# Altium schematic sheet Main_SCH.SchDoc
size A1
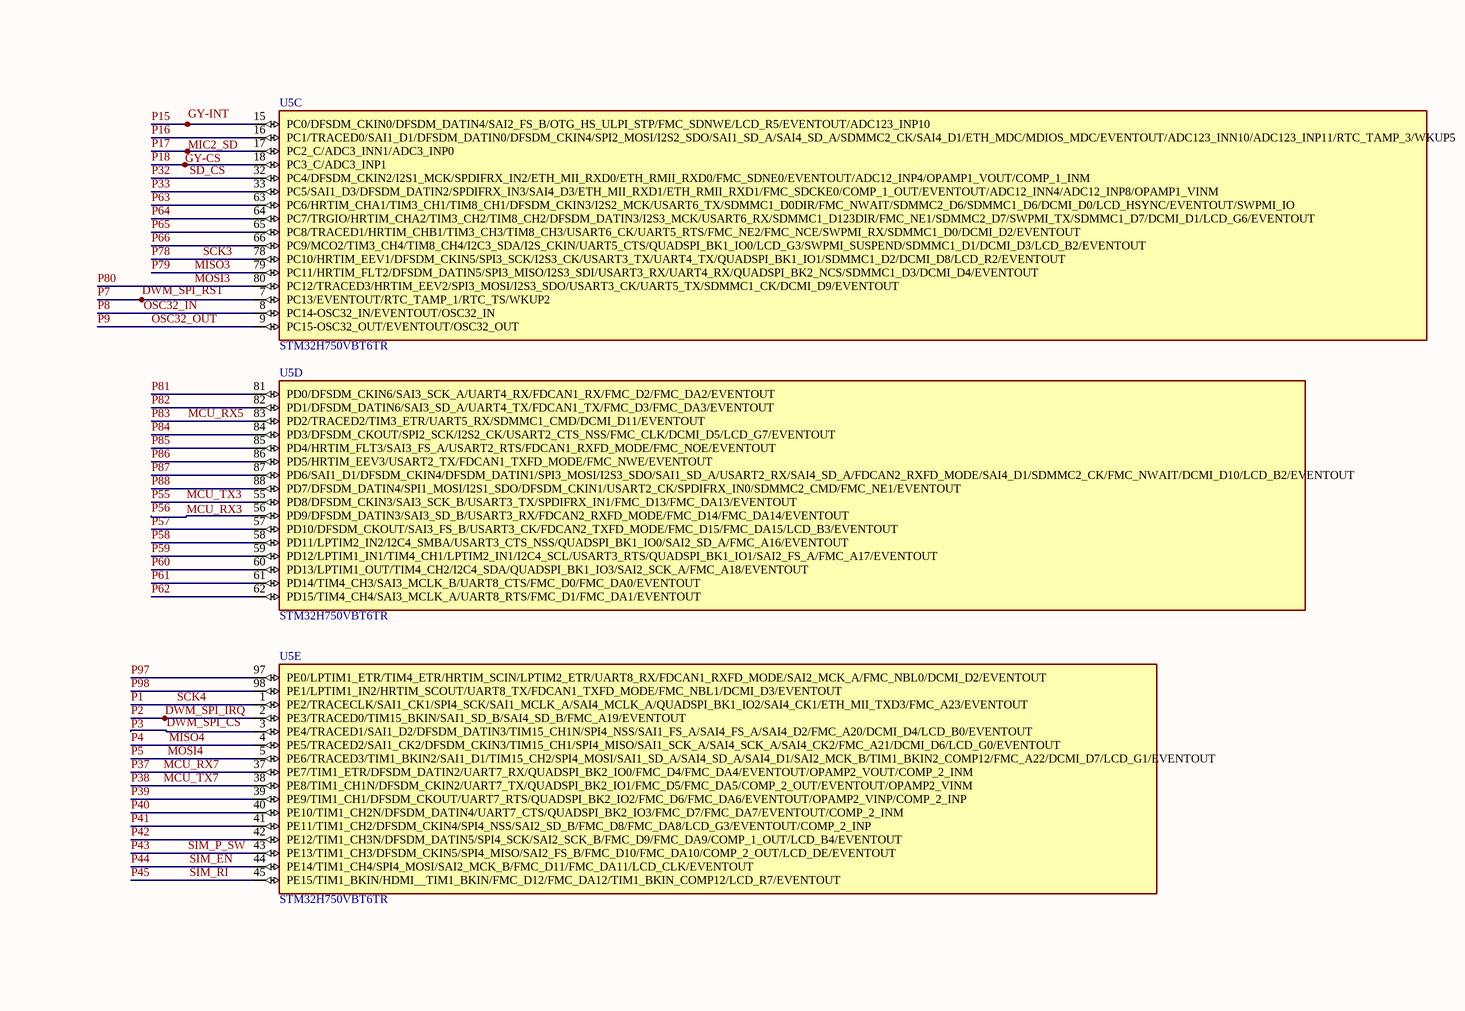
[diagram p0: Main_SCH.SchDoc, top left]
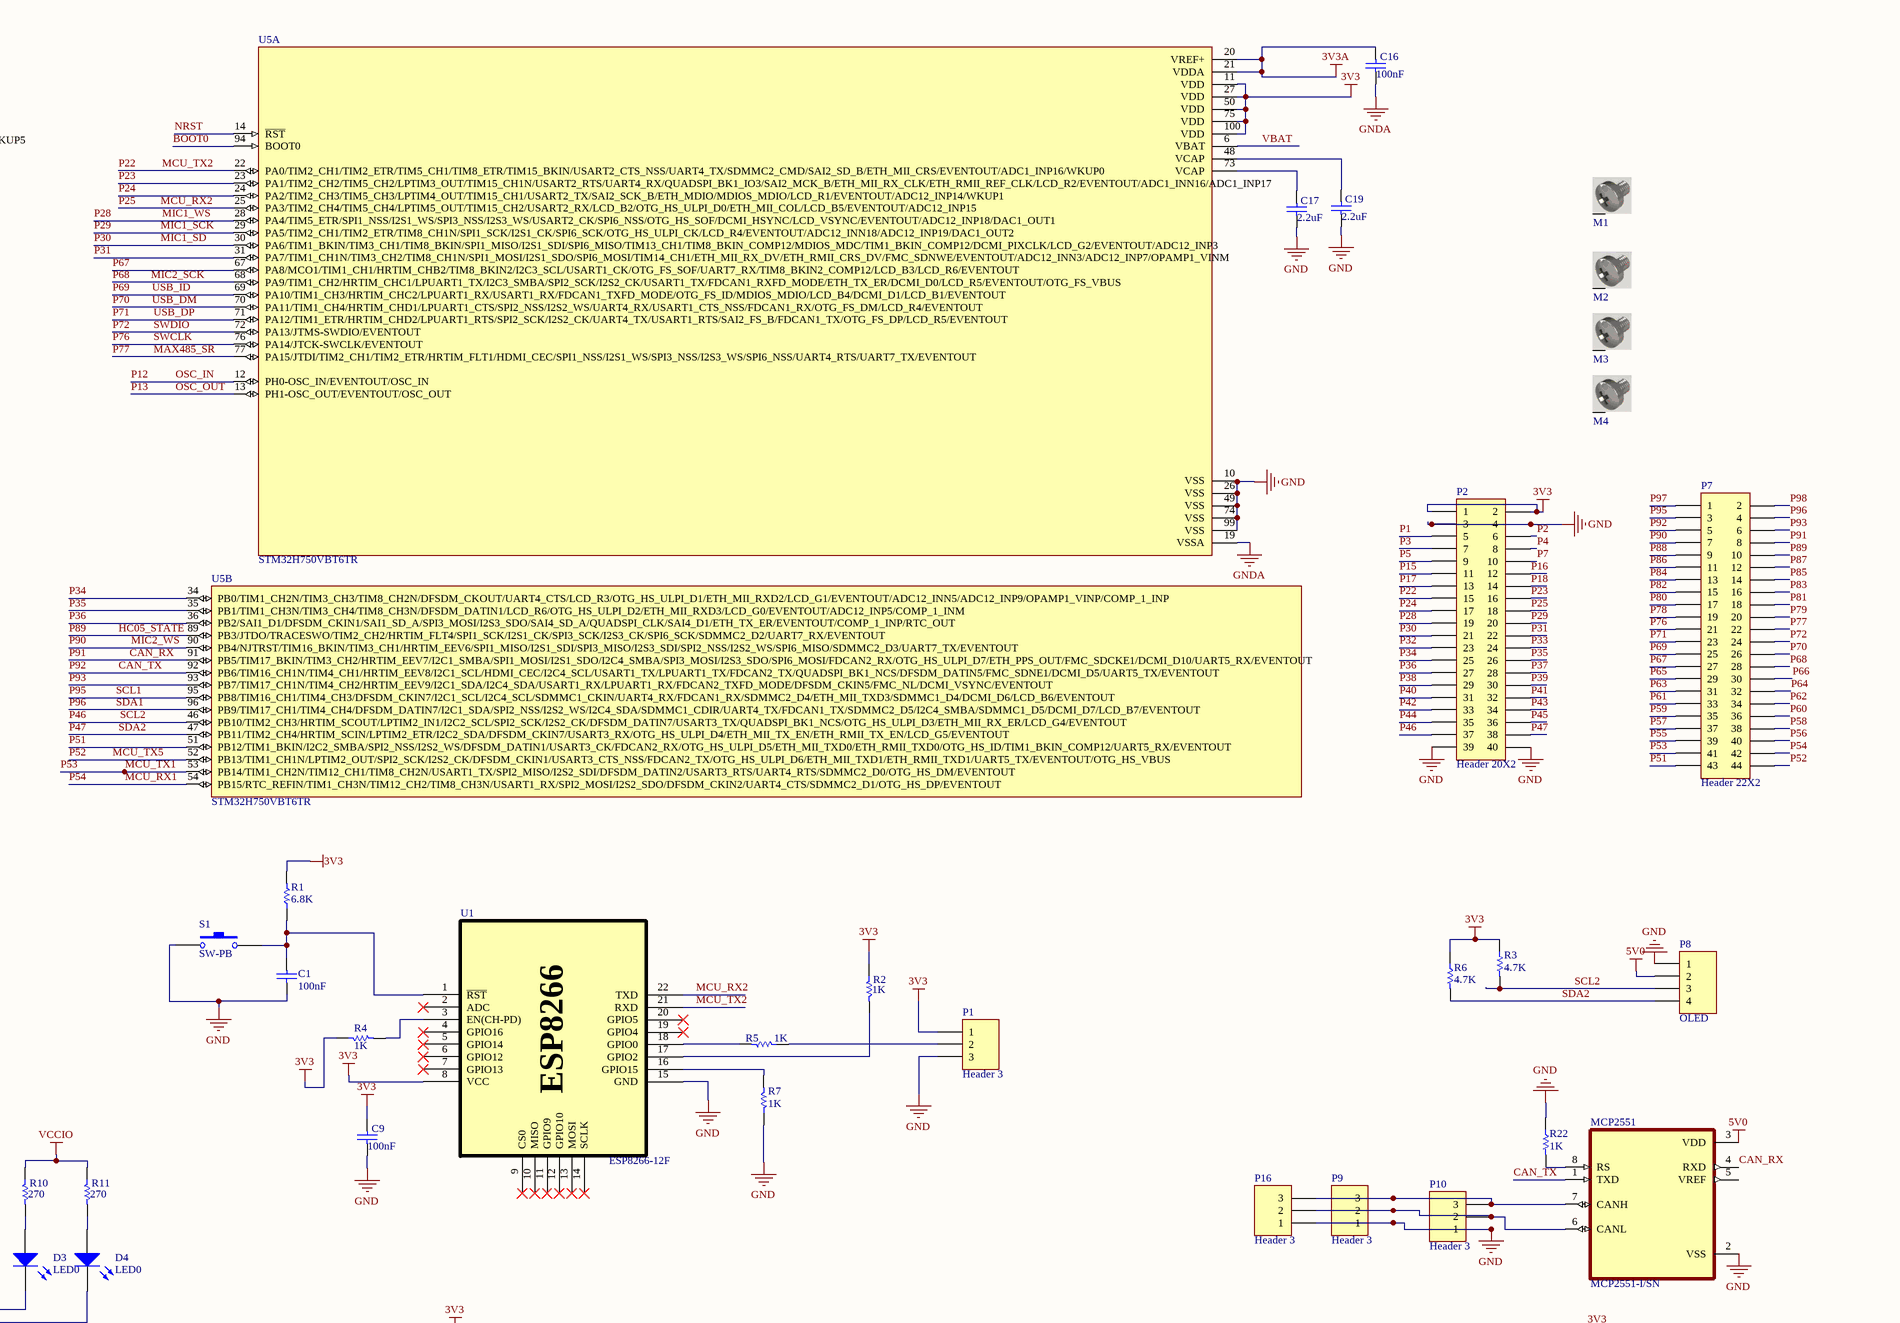
[diagram p1: Main_SCH.SchDoc, top right]
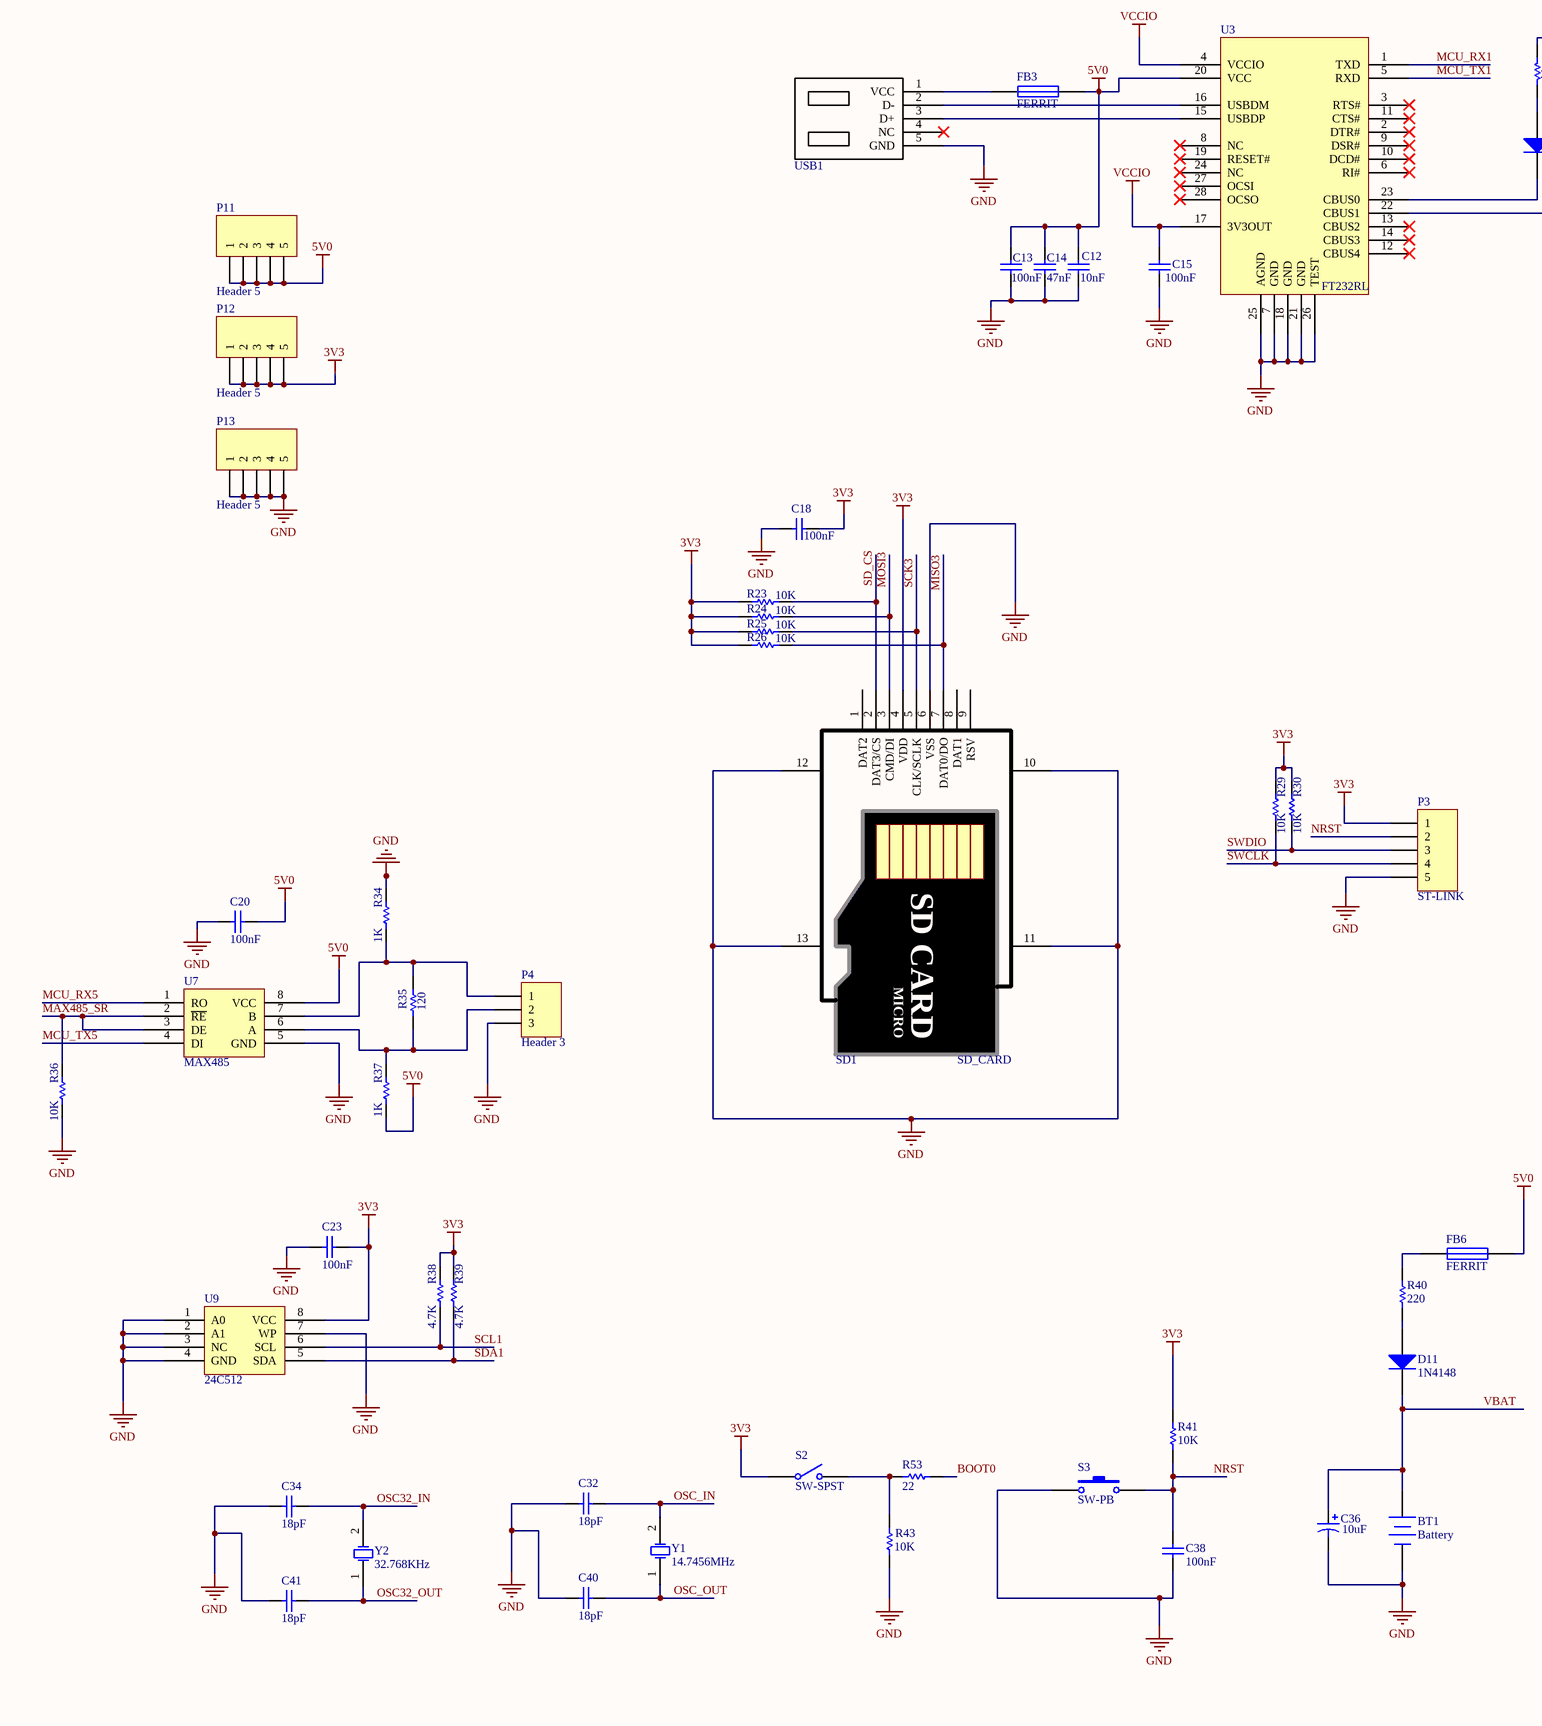
[diagram p2: Main_SCH.SchDoc, bottom left]
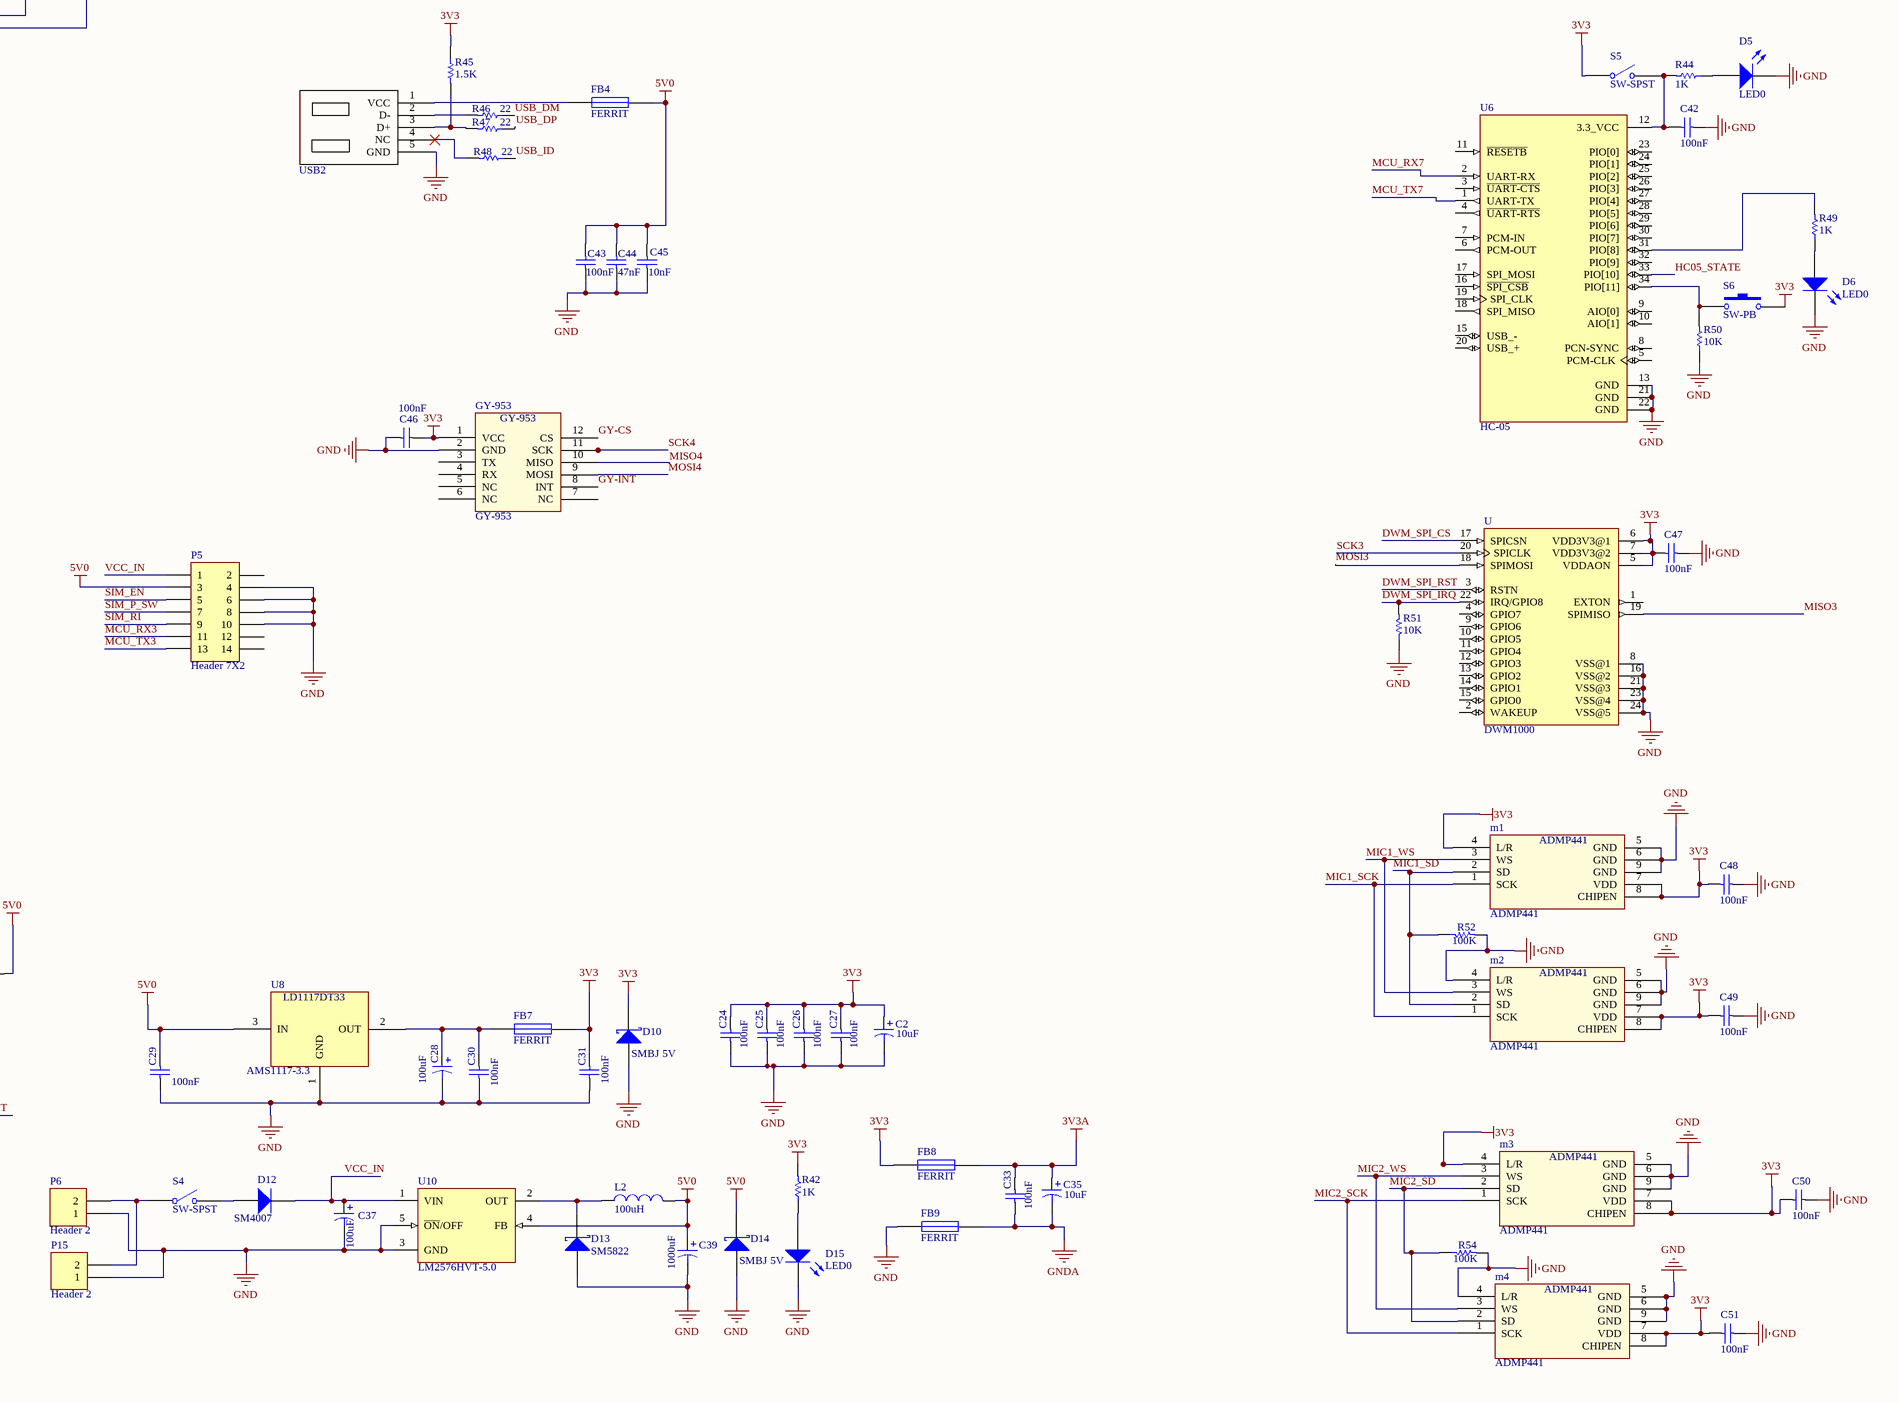
[diagram p3: Main_SCH.SchDoc, bottom right]

## Parts
(Parts that share a designator on the sheet are numbered #1, #2 ... from top to bottom, then left to right.)
BT1  Battery  [CHARGING_BATT]
C1  100nF  [SMD_805]
C2  10uF  [C_B]
C9  100nF  [SMD_805]
C12  10nF  [SMD_805]
C13  100nF  [SMD_805]
C14  47nF  [SMD_805]
C15  100nF  [SMD_805]
C16  100nF  [SMD_805]
C17  2.2uF  [SMD_805]
C18  100nF  [SMD_805]
C19  2.2uF  [SMD_805]
C20  100nF  [SMD_805]
C23  100nF  [SMD_805]
C24  100nF  [SMD_805]
C25  100nF  [SMD_805]
C26  100nF  [SMD_805]
C27  100nF  [SMD_805]
C28  100uF  [C_B]
C29  100nF  [SMD_805]
C30  100nF  [SMD_805]
C31  100nF  [SMD_805]
C32  18pF  [SMD_805]
C33  100nF  [SMD_805]
C34  18pF  [SMD_805]
C35  10uF  [C_B]
C36  10uF  [C_B]
C37  100uF  [C_CYL_SMD2]
C38  100nF  [SMD_805]
C39  1000uF  [C_CYL_SMD]
C40  18pF  [SMD_805]
C41  18pF  [SMD_805]
C42  100nF  [SMD_805]
C43  100nF  [SMD_805]
C44  47nF  [SMD_805]
C45  10nF  [SMD_805]
C46  100nF  [SMD_805]
C47  100nF  [SMD_805]
C48  100nF  [SMD_805]
C49  100nF  [SMD_805]
C50  100nF  [SMD_805]
C51  100nF  [SMD_805]
D3  LED0  [SMD_805]
D4  LED0  [SMD_805]
D5  LED0  [SMD_805]
D6  LED0  [SMD_805]
D10  SMBJ 5V  [tvs]
D11  1N4148  [TVS]
D12  SM4007  [TVS]
D13  SM5822  [DO_214_AB_SMC]
D14  SMBJ 5V  [TVS]
D15  LED0  [SMD_805]
FB3  FERRIT  [SMD_805]
FB4  FERRIT  [SMD_805]
FB6  FERRIT  [SMD_805]
FB7  FERRIT  [SMD_805]
FB8  FERRIT  [SMD_805]
FB9  FERRIT  [SMD_805]
GY-953  GY-953  [GY-953]
L2  100uH  [INDUC_SMD]
M1#1  Screw  [Board Screw_No Silk]  (value not drawn)
m1#2  ADMP441  [ADMP441]
M2#1  Screw  [Board Screw_No Silk]  (value not drawn)
m2#2  ADMP441  [ADMP441]
M3#1  Screw  [Board Screw_No Silk]  (value not drawn)
m3#2  ADMP441  [ADMP441]
M4#1  Screw  [Board Screw_No Silk]  (value not drawn)
m4#2  ADMP441  [ADMP441]
MCP2551  MCP2551-I/SN  [SOIC127P599X175-8N]
P1  Header 3  [HDR1X3]
P2  Header 20X2  [HDR2X20]
P3  ST-LINK  [HDR1X5]
P4  Header 3  [PHOENIX_3]
P5  Header 7X2  [HDR2X7]
P6  Header 2  [adap_jack]
P7  Header 22X2  [HDR2X22]
P8  OLED  [HDR1X4]
P9  Header 3  [HDR1X3]
P10  Header 3  [phoenix_3]
P11  Header 5  [HDR1X5]
P12  Header 5  [HDR1X5]
P13  Header 5  [HDR1X5]
P15  Header 2  [PHOENIX_2]
P16  Header 3  [HDR1X3]
R1  6.8K  [SMD_805]
R2  1K  [SMD_805]
R3  4.7K  [SMD_805]
R4  1K  [SMD_805]
R5  1K  [SMD_805]
R6  4.7K  [SMD_805]
R7  1K  [SMD_805]
R10  270  [SMD_805]
R11  270  [SMD_805]
R22  1K  [SMD_805]
R23  10K  [SMD_805]
R24  10K  [SMD_805]
R25  10K  [SMD_805]
R26  10K  [SMD_805]
R29  10K  [SMD_805]
R30  10K  [SMD_805]
R34  1K  [SMD_805]
R35  120  [SMD_805]
R36  10K  [SMD_805]
R37  1K  [SMD_805]
R38  4.7K  [SMD_805]
R39  4.7K  [SMD_805]
R40  220  [SMD_805]
R41  10K  [SMD_805]
R42  1K  [SMD_805]
R43  10K  [SMD_805]
R44  1K  [SMD_805]
R45  1.5K  [SMD_805]
R46  22  [SMD_805]
R47  22  [SMD_805]
R48  22  [SMD_805]
R49  1K  [SMD_805]
R50  10K  [SMD_805]
R51  10K  [SMD_805]
R52  100K  [SMD_805]
R53  22  [SMD_805]
R54  100K  [SMD_805]
S1  SW-PB  [smd_button]
S2  SW-SPST  [KEY1]
S3  SW-PB  [smd_button]
S4  SW-SPST  [KEY1]
S5  SW-SPST  [KEY1]
S6  SW-PB  [smd_button]
SD1  SD_CARD  [SD_CARD_HOLDER]
U  DWM1000  [XCVR_DWM1000]
U1  ESP8266-12F  [ESP8266_12E]
U3  FT232RL  [SOP28]
U5  STM32H750VBT6TR  [QFP50P1600X1600X160-100N]  (parts A,B,C,D,E of 5)
U6  HC-05  [XCVR_HC-05]
U7  MAX485  [SOP8]
U8  AMS1117-3.3  [SOT223]
U9  24C512  [SOP8]
U10  LM2576HVT-5.0  [LM2576_SMD]
USB1  MICRO_USB  [MINI_USB]  (value not drawn)
USB2  MICRO_USB  [MINI_USB]  (value not drawn)
Y1  14.7456MHz  [xtal_smd]
Y2  32.768KHz  [xtal_rtc]

## Nets
3V3: C2.1 C9.2 C18.2 C23.1 C24.2 C25.2 C26.2 C27.2 C31.2 C46.1 C47.1 C48.1 C49.1 C50.1 C51.1 D10.2(K) FB7.1 FB8.2 GY-953.1(VCC) m1#2.4(L/R) m1#2.7(VDD) m1#2.8(CHIPEN) m2#2.7(VDD) m2#2.8(CHIPEN) m3#2.4(L/R) m3#2.7(VDD) m3#2.8(CHIPEN) m4#2.7(VDD) m4#2.8(CHIPEN) P1.1 P2.1 P2.2 P3.1 P12.1 P12.2 P12.3 P12.4 P12.5 R1.2 R2.1 R3.1 R4.1 R6.1 R23.1 R24.1 R25.1 R26.1 R29.2 R30.2 R38.2 R39.2 R41.2 R42.2 R45.1 S2.1(COMMON) S5.1(COMMON) S6.2 SD1.4(VDD) U.5(VDDAON) U.6(VDD3V3@1) U.7(VDD3V3@2) U1.8(VCC) U5.11(VDD) U5.27(VDD) U5.50(VDD) U5.75(VDD) U5.100(VDD) U9.8(VCC)
3V3A: C16.2 C33.2 C35.1 FB8.1 U5.20(VREF+) U5.21(VDDA)
5V0: C12.2 C13.2 C14.2 C20.1 C29.2 C39.1 C43.2 C44.2 C45.2 D14.2(K) FB3.1 FB4.1 FB6.1 L2.2 MCP2551.3(VDD) P5.3 P8.2 P11.1 P11.2 P11.3 P11.4 P11.5 R37.1 U3.20(VCC) U7.8(VCC) U8.3(IN) U10.4(FB)
GND: BT1.2(-) C1.1 C2.2 C9.1 C12.1 C13.1 C14.1 C15.1 C17.1 C18.1 C19.1 C20.2 C23.2 C24.1 C25.1 C26.1 C27.1 C28.2 C29.1 C30.1 C31.1 C32.2 C34.2 C36.2 C37.2 C38.1 C39.2 C40.2 C41.2 C42.2 C43.1 C44.1 C45.1 C46.2 C47.2 C48.2 C49.2 C50.2 C51.2 D5.2(K) D6.2(K) D10.1(A) D13.1(A) D14.1(A) D15.2(K) FB9.2 GY-953.2(GND) m1#2.5(GND) m1#2.6(GND) m1#2.9(GND) m2#2.4(L/R) m2#2.5(GND) m2#2.6(GND) m2#2.9(GND) m3#2.5(GND) m3#2.6(GND) m3#2.9(GND) m4#2.4(L/R) m4#2.5(GND) m4#2.6(GND) m4#2.9(GND) MCP2551.2(VSS) P1.3 P2.3 P2.4 P2.39 P2.40 P3.5 P4.3 P5.4 P5.6 P5.8 P5.10 P6.1 P8.1 P9.1 P10.1 P13.1 P13.2 P13.3 P13.4 P13.5 P15.1 P16.1 R7.1 R22.1 R34.2 R36.1 R43.1 R50.1 R51.1 R52.2 R54.2 S1.1 S3.1 SD1.6(VSS) SD1.10(BODY) SD1.11(BODY) SD1.12(BODY) SD1.13(BODY) U.8(VSS@1) U.16(VSS@2) U.21(VSS@3) U.23(VSS@4) U.24(VSS@5) U1.15(GND) U3.7(GND) U3.18(GND) U3.21(GND) U3.25(AGND) U3.26(TEST) U5.10(VSS) U5.26(VSS) U5.49(VSS) U5.74(VSS) U5.99(VSS) U6.13(GND) U6.21(GND) U6.22(GND) U7.5(GND) U8.1(GND) U9.1(A0) U9.2(A1) U9.3(NC) U9.4(GND) U9.7(WP) U10.3(GND) U10.5(~{ON}/OFF) USB1.5(GND) USB2.5(GND)
GNDA: C16.1 C33.1 C35.2 FB9.1 U5.19(VSSA)
VCCIO: C15.2 R10.1 R11.1 U3.4(VCCIO) U3.17(3V3OUT)
BOOT0: R53.1 U5.94(BOOT0)
CAN_RX: MCP2551.4(RXD) P7.8 U5.91(PB5/TIM17_BKIN/TIM3_CH2/HRTIM_EEV7/I2C1_SMBA/SPI1_MOSI/I2S1_SDO/I2C4_SMBA/SPI3_MOSI/I2S3_SDO/SPI6_MOSI/FDCAN2_RX/OTG_HS_ULPI_D7/ETH_PPS_OUT/FMC_SDCKE1/DCMI_D10/UART5_RX/EVENTOUT)  [also labelled P91]
CAN_TX: MCP2551.1(TXD) P7.5 U5.92(PB6/TIM16_CH1N/TIM4_CH1/HRTIM_EEV8/I2C1_SCL/HDMI_CEC/I2C4_SCL/USART1_TX/LPUART1_TX/FDCAN2_TX/QUADSPI_BK1_NCS/DFSDM_DATIN5/FMC_SDNE1/DCMI_D5/UART5_TX/EVENTOUT)  [also labelled P92]
DWM_SPI_CS: P2.7 U.17(SPICSN) U5.3(PE4/TRACED1/SAI1_D2/DFSDM_DATIN3/TIM15_CH1N/SPI4_NSS/SAI1_FS_A/SAI4_FS_A/SAI4_D2/FMC_A20/DCMI_D4/LCD_B0/EVENTOUT)  [also labelled P3]
DWM_SPI_IRQ: P2.6 R51.2 U.22(IRQ/GPIO8) U5.2(PE3/TRACED0/TIM15_BKIN/SAI1_SD_B/SAI4_SD_B/FMC_A19/EVENTOUT)  [also labelled P2]
DWM_SPI_RST: P2.10 U.3(RSTN) U5.7(PC13/EVENTOUT/RTC_TAMP_1/RTC_TS/WKUP2)  [also labelled P7]
GY-CS: GY-953.12(CS) P2.14 U5.18(PC3_C/ADC3_INP1)  [also labelled P18]
GY-INT: GY-953.8(INT) P2.11 U5.15(PC0/DFSDM_CKIN0/DFSDM_DATIN4/SAI2_FS_B/OTG_HS_ULPI_STP/FMC_SDNWE/LCD_R5/EVENTOUT/ADC123_INP10)  [also labelled P15]
HC05_STATE: P7.10 U5.89(PB3/JTDO/TRACESWO/TIM2_CH2/HRTIM_FLT4/SPI1_SCK/I2S1_CK/SPI3_SCK/I2S3_CK/SPI6_SCK/SDMMC2_D2/UART7_RX/EVENTOUT) U6.33(PIO[10])  [also labelled P89]
MAX485_SR: P7.22 R36.2 U5.77(PA15/JTDI/TIM2_CH1/TIM2_ETR/HRTIM_FLT1/HDMI_CEC/SPI1_NSS/I2S1_WS/SPI3_NSS/I2S3_WS/SPI6_NSS/UART4_RTS/UART7_TX/EVENTOUT) U7.2(~{RE}) U7.3(DE)  [also labelled P77]
MCU_RX1: P7.42 U3.1(TXD) U5.54(PB15/RTC_REFIN/TIM1_CH3N/TIM12_CH2/TIM8_CH3N/USART1_RX/SPI2_MOSI/I2S2_SDO/DFSDM_CKIN2/UART4_CTS/SDMMC2_D1/OTG_HS_DP/EVENTOUT)  [also labelled P54]
MCU_RX2: P2.18 U1.22(TXD) U5.25(PA3/TIM2_CH4/TIM5_CH4/LPTIM5_OUT/TIM15_CH2/USART2_RX/LCD_B2/OTG_HS_ULPI_D0/ETH_MII_COL/LCD_B5/EVENTOUT/ADC12_INP15)  [also labelled P25]
MCU_RX3: P5.11 P7.40 U5.56(PD9/DFSDM_DATIN3/SAI3_SD_B/USART3_RX/FDCAN2_RXFD_MODE/FMC_D14/FMC_DA14/EVENTOUT)  [also labelled P56]
MCU_RX5: P7.16 U5.83(PD2/TRACED2/TIM3_ETR/UART5_RX/SDMMC1_CMD/DCMI_D11/EVENTOUT) U7.1(RO)  [also labelled P83]
MCU_RX7: P2.28 U5.37(PE7/TIM1_ETR/DFSDM_DATIN2/UART7_RX/QUADSPI_BK2_IO0/FMC_D4/FMC_DA4/EVENTOUT/OPAMP2_VOUT/COMP_2_INM) U6.2(UART-RX)  [also labelled P37]
MCU_TX1: P7.41 U3.5(RXD) U5.53(PB14/TIM1_CH2N/TIM12_CH1/TIM8_CH2N/USART1_TX/SPI2_MISO/I2S2_SDI/DFSDM_DATIN2/USART3_RTS/UART4_RTS/SDMMC2_D0/OTG_HS_DM/EVENTOUT)  [also labelled P53]
MCU_TX2: P2.15 U1.21(RXD) U5.22(PA0/TIM2_CH1/TIM2_ETR/TIM5_CH1/TIM8_ETR/TIM15_BKIN/USART2_CTS_NSS/UART4_TX/SDMMC2_CMD/SAI2_SD_B/ETH_MII_CRS/EVENTOUT/ADC1_INP16/WKUP0)  [also labelled P22]
MCU_TX3: P5.13 P7.39 U5.55(PD8/DFSDM_CKIN3/SAI3_SCK_B/USART3_TX/SPDIFRX_IN1/FMC_D13/FMC_DA13/EVENTOUT)  [also labelled P55]
MCU_TX5: P7.44 U5.52(PB13/TIM1_CH1N/LPTIM2_OUT/SPI2_SCK/I2S2_CK/DFSDM_CKIN1/USART3_CTS_NSS/FDCAN2_TX/OTG_HS_ULPI_D6/ETH_MII_TXD1/ETH_RMII_TXD1/UART5_TX/EVENTOUT/OTG_HS_VBUS) U7.4(DI)  [also labelled P52]
MCU_TX7: P2.29 U5.38(PE8/TIM1_CH1N/DFSDM_CKIN2/UART7_TX/QUADSPI_BK2_IO1/FMC_D5/FMC_DA5/COMP_2_OUT/EVENTOUT/OPAMP2_VINM) U6.1(UART-TX)  [also labelled P38]
MIC1_SCK: m1#2.1(SCK) m2#2.1(SCK) P2.20 U5.29(PA5/TIM2_CH1/TIM2_ETR/TIM8_CH1N/SPI1_SCK/I2S1_CK/SPI6_SCK/OTG_HS_ULPI_CK/LCD_R4/EVENTOUT/ADC12_INN18/ADC12_INP19/DAC1_OUT2)  [also labelled P29]
MIC1_SD: m1#2.2(SD) m2#2.2(SD) P2.21 R52.1 U5.30(PA6/TIM1_BKIN/TIM3_CH1/TIM8_BKIN/SPI1_MISO/I2S1_SDI/SPI6_MISO/TIM13_CH1/TIM8_BKIN_COMP12/MDIOS_MDC/TIM1_BKIN_COMP12/DCMI_PIXCLK/LCD_G2/EVENTOUT/ADC12_INP3)  [also labelled P30]
MIC1_WS: m1#2.3(WS) m2#2.3(WS) P2.19 U5.28(PA4/TIM5_ETR/SPI1_NSS/I2S1_WS/SPI3_NSS/I2S3_WS/USART2_CK/SPI6_NSS/OTG_HS_SOF/DCMI_HSYNC/LCD_VSYNC/EVENTOUT/ADC12_INP18/DAC1_OUT1)  [also labelled P28]
MIC2_SCK: m3#2.1(SCK) m4#2.1(SCK) P7.28 U5.68(PA9/TIM1_CH2/HRTIM_CHC1/LPUART1_TX/I2C3_SMBA/SPI2_SCK/I2S2_CK/USART1_TX/FDCAN1_RXFD_MODE/ETH_TX_ER/DCMI_D0/LCD_R5/EVENTOUT/OTG_FS_VBUS)  [also labelled P68]
MIC2_SD: m3#2.2(SD) m4#2.2(SD) P2.13 R54.1 U5.17(PC2_C/ADC3_INN1/ADC3_INP0)  [also labelled P17]
MIC2_WS: m3#2.3(WS) m4#2.3(WS) P7.7 U5.90(PB4/NJTRST/TIM16_BKIN/TIM3_CH1/HRTIM_EEV6/SPI1_MISO/I2S1_SDI/SPI3_MISO/I2S3_SDI/SPI2_NSS/I2S2_WS/SPI6_MISO/SDMMC2_D3/UART7_TX/EVENTOUT)  [also labelled P90]
MISO3: P7.20 R26.2 SD1.7(DAT0/DO) U.19(SPIMISO) U5.79(PC11/HRTIM_FLT2/DFSDM_DATIN5/SPI3_MISO/I2S3_SDI/USART3_RX/UART4_RX/QUADSPI_BK2_NCS/SDMMC1_D3/DCMI_D4/EVENTOUT)  [also labelled P79]
MISO4: GY-953.10(MISO) P2.8 U5.4(PE5/TRACED2/SAI1_CK2/DFSDM_CKIN3/TIM15_CH1/SPI4_MISO/SAI1_SCK_A/SAI4_SCK_A/SAI4_CK2/FMC_A21/DCMI_D6/LCD_G0/EVENTOUT)  [also labelled P4]
MOSI3: P7.17 R24.2 SD1.3(CMD/DI) U.18(SPIMOSI) U5.80(PC12/TRACED3/HRTIM_EEV2/SPI3_MOSI/I2S3_SDO/USART3_CK/UART5_TX/SDMMC1_CK/DCMI_D9/EVENTOUT)  [also labelled P80]
MOSI4: GY-953.9(MOSI) P2.9 U5.5(PE6/TRACED3/TIM1_BKIN2/SAI1_D1/TIM15_CH2/SPI4_MOSI/SAI1_SD_A/SAI4_SD_A/SAI4_D1/SAI2_MCK_B/TIM1_BKIN2_COMP12/FMC_A22/DCMI_D7/LCD_G1/EVENTOUT)  [also labelled P5]
NRST: C38.2 P3.2 R41.1 S3.2 U5.14(~{RST})
OSC32_IN: C34.1 U5.8(PC14-OSC32_IN/EVENTOUT/OSC32_IN) Y2.2(OSC2)  [also labelled P8]
OSC32_OUT: C41.1 U5.9(PC15-OSC32_OUT/EVENTOUT/OSC32_OUT) Y2.1(OSC1)  [also labelled P9]
OSC_IN: C32.1 U5.12(PH0-OSC_IN/EVENTOUT/OSC_IN) Y1.2(OSC2)  [also labelled P12]
OSC_OUT: C40.1 U5.13(PH1-OSC_OUT/EVENTOUT/OSC_OUT) Y1.1(OSC1)  [also labelled P13]
P1: GY-953.11(SCK) P2.5 U5.1(PE2/TRACECLK/SAI1_CK1/SPI4_SCK/SAI1_MCLK_A/SAI4_MCLK_A/QUADSPI_BK1_IO2/SAI4_CK1/ETH_MII_TXD3/FMC_A23/EVENTOUT)  [also labelled SCK4]
P16: P2.12 U5.16(PC1/TRACED0/SAI1_D1/DFSDM_DATIN0/DFSDM_CKIN4/SPI2_MOSI/I2S2_SDO/SAI1_SD_A/SAI4_SD_A/SDMMC2_CK/SAI4_D1/ETH_MDC/MDIOS_MDC/EVENTOUT/ADC123_INN10/ADC123_INP11/RTC_TAMP_3/WKUP5)
P23: P2.16 U5.23(PA1/TIM2_CH2/TIM5_CH2/LPTIM3_OUT/TIM15_CH1N/USART2_RTS/UART4_RX/QUADSPI_BK1_IO3/SAI2_MCK_B/ETH_MII_RX_CLK/ETH_RMII_REF_CLK/LCD_R2/EVENTOUT/ADC1_INN16/ADC1_INP17)
P24: P2.17 U5.24(PA2/TIM2_CH3/TIM5_CH3/LPTIM4_OUT/TIM15_CH1/USART2_TX/SAI2_SCK_B/ETH_MDIO/MDIOS_MDIO/LCD_R1/EVENTOUT/ADC12_INP14/WKUP1)
P31: P2.22 U5.31(PA7/TIM1_CH1N/TIM3_CH2/TIM8_CH1N/SPI1_MOSI/I2S1_SDO/SPI6_MOSI/TIM14_CH1/ETH_MII_RX_DV/ETH_RMII_CRS_DV/FMC_SDNWE/EVENTOUT/ADC12_INN3/ADC12_INP7/OPAMP1_VINM)
P32: P2.23 R23.2 SD1.2(DAT3/CS) U5.32(PC4/DFSDM_CKIN2/I2S1_MCK/SPDIFRX_IN2/ETH_MII_RXD0/ETH_RMII_RXD0/FMC_SDNE0/EVENTOUT/ADC12_INP4/OPAMP1_VOUT/COMP_1_INM)  [also labelled SD_CS]
P33: P2.24 U5.33(PC5/SAI1_D3/DFSDM_DATIN2/SPDIFRX_IN3/SAI4_D3/ETH_MII_RXD1/ETH_RMII_RXD1/FMC_SDCKE0/COMP_1_OUT/EVENTOUT/ADC12_INN4/ADC12_INP8/OPAMP1_VINM)
P34: P2.25 U5.34(PB0/TIM1_CH2N/TIM3_CH3/TIM8_CH2N/DFSDM_CKOUT/UART4_CTS/LCD_R3/OTG_HS_ULPI_D1/ETH_MII_RXD2/LCD_G1/EVENTOUT/ADC12_INN5/ADC12_INP9/OPAMP1_VINP/COMP_1_INP)
P35: P2.26 U5.35(PB1/TIM1_CH3N/TIM3_CH4/TIM8_CH3N/DFSDM_DATIN1/LCD_R6/OTG_HS_ULPI_D2/ETH_MII_RXD3/LCD_G0/EVENTOUT/ADC12_INP5/COMP_1_INM)
P36: P2.27 U5.36(PB2/SAI1_D1/DFSDM_CKIN1/SAI1_SD_A/SPI3_MOSI/I2S3_SDO/SAI4_SD_A/QUADSPI_CLK/SAI4_D1/ETH_TX_ER/EVENTOUT/COMP_1_INP/RTC_OUT)
P39: P2.30 U5.39(PE9/TIM1_CH1/DFSDM_CKOUT/UART7_RTS/QUADSPI_BK2_IO2/FMC_D6/FMC_DA6/EVENTOUT/OPAMP2_VINP/COMP_2_INP)
P40: P2.31 U5.40(PE10/TIM1_CH2N/DFSDM_DATIN4/UART7_CTS/QUADSPI_BK2_IO3/FMC_D7/FMC_DA7/EVENTOUT/COMP_2_INM)
P41: P2.32 U5.41(PE11/TIM1_CH2/DFSDM_CKIN4/SPI4_NSS/SAI2_SD_B/FMC_D8/FMC_DA8/LCD_G3/EVENTOUT/COMP_2_INP)
P42: P2.33 U5.42(PE12/TIM1_CH3N/DFSDM_DATIN5/SPI4_SCK/SAI2_SCK_B/FMC_D9/FMC_DA9/COMP_1_OUT/LCD_B4/EVENTOUT)
P43: P2.34 P5.7 U5.43(PE13/TIM1_CH3/DFSDM_CKIN5/SPI4_MISO/SAI2_FS_B/FMC_D10/FMC_DA10/COMP_2_OUT/LCD_DE/EVENTOUT)  [also labelled SIM_P_SW]
P44: P2.35 P5.5 U5.44(PE14/TIM1_CH4/SPI4_MOSI/SAI2_MCK_B/FMC_D11/FMC_DA11/LCD_CLK/EVENTOUT)  [also labelled SIM_EN]
P45: P2.36 P5.9 U5.45(PE15/TIM1_BKIN/HDMI__TIM1_BKIN/FMC_D12/FMC_DA12/TIM1_BKIN_COMP12/LCD_R7/EVENTOUT)  [also labelled SIM_RI]
P46: P2.37 P8.3 R3.2 U5.46(PB10/TIM2_CH3/HRTIM_SCOUT/LPTIM2_IN1/I2C2_SCL/SPI2_SCK/I2S2_CK/DFSDM_DATIN7/USART3_TX/QUADSPI_BK1_NCS/OTG_HS_ULPI_D3/ETH_MII_RX_ER/LCD_G4/EVENTOUT)  [also labelled SCL2]
P47: P2.38 P8.4 R6.2 U5.47(PB11/TIM2_CH4/HRTIM_SCIN/LPTIM2_ETR/I2C2_SDA/DFSDM_CKIN7/USART3_RX/OTG_HS_ULPI_D4/ETH_MII_TX_EN/ETH_RMII_TX_EN/LCD_G5/EVENTOUT)  [also labelled SDA2]
P51: P7.43 U5.51(PB12/TIM1_BKIN/I2C2_SMBA/SPI2_NSS/I2S2_WS/DFSDM_DATIN1/USART3_CK/FDCAN2_RX/OTG_HS_ULPI_D5/ETH_MII_TXD0/ETH_RMII_TXD0/OTG_HS_ID/TIM1_BKIN_COMP12/UART5_RX/EVENTOUT)
P57: P7.37 U5.57(PD10/DFSDM_CKOUT/SAI3_FS_B/USART3_CK/FDCAN2_TXFD_MODE/FMC_D15/FMC_DA15/LCD_B3/EVENTOUT)
P58: P7.38 U5.58(PD11/LPTIM2_IN2/I2C4_SMBA/USART3_CTS_NSS/QUADSPI_BK1_IO0/SAI2_SD_A/FMC_A16/EVENTOUT)
P59: P7.35 U5.59(PD12/LPTIM1_IN1/TIM4_CH1/LPTIM2_IN1/I2C4_SCL/USART3_RTS/QUADSPI_BK1_IO1/SAI2_FS_A/FMC_A17/EVENTOUT)
P60: P7.36 U5.60(PD13/LPTIM1_OUT/TIM4_CH2/I2C4_SDA/QUADSPI_BK1_IO3/SAI2_SCK_A/FMC_A18/EVENTOUT)
P61: P7.33 U5.61(PD14/TIM4_CH3/SAI3_MCLK_B/UART8_CTS/FMC_D0/FMC_DA0/EVENTOUT)
P62: P7.34 U5.62(PD15/TIM4_CH4/SAI3_MCLK_A/UART8_RTS/FMC_D1/FMC_DA1/EVENTOUT)
P63: P7.31 U5.63(PC6/HRTIM_CHA1/TIM3_CH1/TIM8_CH1/DFSDM_CKIN3/I2S2_MCK/USART6_TX/SDMMC1_D0DIR/FMC_NWAIT/SDMMC2_D6/SDMMC1_D6/DCMI_D0/LCD_HSYNC/EVENTOUT/SWPMI_IO)
P64: P7.32 U5.64(PC7/TRGIO/HRTIM_CHA2/TIM3_CH2/TIM8_CH2/DFSDM_DATIN3/I2S3_MCK/USART6_RX/SDMMC1_D123DIR/FMC_NE1/SDMMC2_D7/SWPMI_TX/SDMMC1_D7/DCMI_D1/LCD_G6/EVENTOUT)
P65: P7.29 U5.65(PC8/TRACED1/HRTIM_CHB1/TIM3_CH3/TIM8_CH3/USART6_CK/UART5_RTS/FMC_NE2/FMC_NCE/SWPMI_RX/SDMMC1_D0/DCMI_D2/EVENTOUT)
P66: P7.30 U5.66(PC9/MCO2/TIM3_CH4/TIM8_CH4/I2C3_SDA/I2S_CKIN/UART5_CTS/QUADSPI_BK1_IO0/LCD_G3/SWPMI_SUSPEND/SDMMC1_D1/DCMI_D3/LCD_B2/EVENTOUT)
P67: P7.27 U5.67(PA8/MCO1/TIM1_CH1/HRTIM_CHB2/TIM8_BKIN2/I2C3_SCL/USART1_CK/OTG_FS_SOF/UART7_RX/TIM8_BKIN2_COMP12/LCD_B3/LCD_R6/EVENTOUT)
P69: P7.25 R48.1 U5.69(PA10/TIM1_CH3/HRTIM_CHC2/LPUART1_RX/USART1_RX/FDCAN1_TXFD_MODE/OTG_FS_ID/MDIOS_MDIO/LCD_B4/DCMI_D1/LCD_B1/EVENTOUT)  [also labelled USB_ID]
P70: P7.26 R46.1 U5.70(PA11/TIM1_CH4/HRTIM_CHD1/LPUART1_CTS/SPI2_NSS/I2S2_WS/UART4_RX/USART1_CTS_NSS/FDCAN1_RX/OTG_FS_DM/LCD_R4/EVENTOUT)  [also labelled USB_DM]
P71: P7.23 R47.1 U5.71(PA12/TIM1_ETR/HRTIM_CHD2/LPUART1_RTS/SPI2_SCK/I2S2_CK/UART4_TX/USART1_RTS/SAI2_FS_B/FDCAN1_TX/OTG_FS_DP/LCD_R5/EVENTOUT)  [also labelled USB_DP]
P72: P3.3 P7.24 R30.1 U5.72(PA13/JTMS-SWDIO/EVENTOUT)  [also labelled SWDIO]
P76: P3.4 P7.21 R29.1 U5.76(PA14/JTCK-SWCLK/EVENTOUT)  [also labelled SWCLK]
P78: P7.19 R25.2 SD1.5(CLK/SCLK) U.20(SPICLK) U5.78(PC10/HRTIM_EEV1/DFSDM_CKIN5/SPI3_SCK/I2S3_CK/USART3_TX/UART4_TX/QUADSPI_BK1_IO1/SDMMC1_D2/DCMI_D8/LCD_R2/EVENTOUT)  [also labelled SCK3]
P81: P7.18 U5.81(PD0/DFSDM_CKIN6/SAI3_SCK_A/UART4_RX/FDCAN1_RX/FMC_D2/FMC_DA2/EVENTOUT)
P82: P7.15 U5.82(PD1/DFSDM_DATIN6/SAI3_SD_A/UART4_TX/FDCAN1_TX/FMC_D3/FMC_DA3/EVENTOUT)
P84: P7.13 U5.84(PD3/DFSDM_CKOUT/SPI2_SCK/I2S2_CK/USART2_CTS_NSS/FMC_CLK/DCMI_D5/LCD_G7/EVENTOUT)
P85: P7.14 U5.85(PD4/HRTIM_FLT3/SAI3_FS_A/USART2_RTS/FDCAN1_RXFD_MODE/FMC_NOE/EVENTOUT)
P86: P7.11 U5.86(PD5/HRTIM_EEV3/USART2_TX/FDCAN1_TXFD_MODE/FMC_NWE/EVENTOUT)
P87: P7.12 U5.87(PD6/SAI1_D1/DFSDM_CKIN4/DFSDM_DATIN1/SPI3_MOSI/I2S3_SDO/SAI1_SD_A/USART2_RX/SAI4_SD_A/FDCAN2_RXFD_MODE/SAI4_D1/SDMMC2_CK/FMC_NWAIT/DCMI_D10/LCD_B2/EVENTOUT)
P88: P7.9 U5.88(PD7/DFSDM_DATIN4/SPI1_MOSI/I2S1_SDO/DFSDM_CKIN1/USART2_CK/SPDIFRX_IN0/SDMMC2_CMD/FMC_NE1/EVENTOUT)
P93: P7.6 U5.93(PB7/TIM17_CH1N/TIM4_CH2/HRTIM_EEV9/I2C1_SDA/I2C4_SDA/USART1_RX/LPUART1_RX/FDCAN2_TXFD_MODE/DFSDM_CKIN5/FMC_NL/DCMI_VSYNC/EVENTOUT)
P95: P7.3 R38.1 U5.95(PB8/TIM16_CH1/TIM4_CH3/DFSDM_CKIN7/I2C1_SCL/I2C4_SCL/SDMMC1_CKIN/UART4_RX/FDCAN1_RX/SDMMC2_D4/ETH_MII_TXD3/SDMMC1_D4/DCMI_D6/LCD_B6/EVENTOUT) U9.6(SCL)  [also labelled SCL1]
P96: P7.4 R39.1 U5.96(PB9/TIM17_CH1/TIM4_CH4/DFSDM_DATIN7/I2C1_SDA/SPI2_NSS/I2S2_WS/I2C4_SDA/SDMMC1_CDIR/UART4_TX/FDCAN1_TX/SDMMC2_D5/I2C4_SMBA/SDMMC1_D5/DCMI_D7/LCD_B7/EVENTOUT) U9.5(SDA)  [also labelled SDA1]
P97: P7.1 U5.97(PE0/LPTIM1_ETR/TIM4_ETR/HRTIM_SCIN/LPTIM2_ETR/UART8_RX/FDCAN1_RXFD_MODE/SAI2_MCK_A/FMC_NBL0/DCMI_D2/EVENTOUT)
P98: P7.2 U5.98(PE1/LPTIM1_IN2/HRTIM_SCOUT/UART8_TX/FDCAN1_TXFD_MODE/FMC_NBL1/DCMI_D3/EVENTOUT)
VBAT: BT1.1(+) C36.1 D11.2(K) U5.6(VBAT)
VCC_IN: C37.1 D12.2(K) P5.1 U10.1(VIN)
NetC1_2: C1.2 R1.1 S1.2 U1.1(~{RST})
NetC17_2: C17.2 U5.73(VCAP)
NetC19_2: C19.2 U5.48(VCAP)
NetC28_1: C28.1 C30.2 FB7.2 U8.2(OUT)
NetC42_1: C42.1 R44.2 S5.2(NO) U6.12(3.3_VCC)
NetD3_1: D3.1(A) R10.2
NetD3_2: D3.2(K) U3.23(CBUS0)
NetD4_1: D4.1(A) R11.2
NetD4_2: D4.2(K) U3.22(CBUS1)
NetD5_1: D5.1(A) R44.1
NetD6_1: D6.1(A) R49.1
NetD11_1: D11.1(A) R40.2
NetD12_1: D12.1(A) S4.2(NO)
NetD13_2: D13.2(K) L2.1 U10.2(OUT)
NetD15_1: D15.1(A) R42.1
NetFB3_2: FB3.2 USB1.1(VCC)
NetFB4_2: FB4.2 USB2.1(VCC)
NetFB6_2: FB6.2 R40.1
NetMCP2551_6: MCP2551.6(CANL) P9.2 P10.2 P16.2
NetMCP2551_7: MCP2551.7(CANH) P9.3 P10.3 P16.3
NetMCP2551_8: MCP2551.8(RS) R22.2
NetP1_2: P1.2 R5.1
NetP4_1: P4.1 R34.1 R35.2 U7.7(B)
NetP4_2: P4.2 R35.1 R37.2 U7.6(A)
NetP6_2: P6.2 P15.2 S4.1(COMMON)
NetR2_2: R2.2 U1.17(GPIO2)
NetR4_2: R4.2 U1.3(EN(CH-PD))
NetR5_2: R5.2 U1.18(GPIO0)
NetR7_2: R7.2 U1.16(GPIO15)
NetR43_2: R43.2 R53.2 S2.2(NO)
NetR45_2: R45.2 R47.2 USB2.3(D+)
NetR46_2: R46.2 USB2.2(D-)
NetR48_2: R48.2 USB2.4(NC)
NetR49_2: R49.2 U6.31(PIO[8])
NetR50_2: R50.2 S6.1 U6.34(PIO[11])
NetU3_15: U3.15(USBDP) USB1.3(D+)
NetU3_16: U3.16(USBDM) USB1.2(D-)

Not connected (* = marked no-connect by the designer): GY-953 3(TX) 4(RX) 5(NC) 6(NC) 7(NC); M1#1 S; M2#1 S; M3#1 S; M4#1 S; MCP2551 5(VREF); P5 2 12 14; SD1 1(DAT2) 8(DAT1) 9(RSV); U 1(EXTON) 2(WAKEUP) 4(GPIO7) 9(GPIO6) 10(GPIO5) 11(GPIO4) 12(GPIO3) 13(GPIO2) 14(GPIO1) 15(GPIO0); U1 2(ADC)* 4(GPIO16)* 5(GPIO14)* 6(GPIO12)* 7(GPIO13)* 9(CS0)* 10(MISO)* 11(GPIO9)* 12(GPIO10)* 13(MOSI)* 14(SCLK)* 19(GPIO4)* 20(GPIO5)*; U3 2(DTR#)* 3(RTS#)* 6(RI#)* 8(NC)* 9(DSR#)* 10(DCD#)* 11(CTS#)* 12(CBUS4)* 13(CBUS2)* 14(CBUS3)* 19(RESET#)* 24(NC)* 27(OCSI)* 28(OCSO)*; U6 3(~{UART-CTS}) 4(~{UART-RTS}) 5(PCM-CLK) 6(PCM-OUT) 7(PCM-IN) 8(PCN-SYNC) 9(AIO[0]) 10(AIO[1]) 11(~{RESETB}) 15(USB_-) 16(~{SPI_CSB}) 17(SPI_MOSI) 18(SPI_MISO) 19(SPI_CLK) 20(USB_+) 23(PIO[0]) 24(PIO[1]) 25(PIO[2]) 26(PIO[3]) 27(PIO[4]) 28(PIO[5]) 29(PIO[6]) 30(PIO[7]) 32(PIO[9]); USB1 4(NC)*

## Notes on the sheet
- (in symbol MICRO_SD_CARD_HOLDER) SD CARD; MICRO

## Library data of the parts
BT1 = Battery: Multicell Battery; Published: 24-Mar-1999; LatestRevisionDate: 17-Jul-2002; LatestRevisionNote: Re-released for DXP Platform.; PackageReference: BAT-2; Publisher: Altium Limited
C1 C9 C12-C16 C18 C20 C23-C27 C29-C34 C38 C40-C51 = Cap: Capacitor; Published: 8-Jun-2000; LatestRevisionDate: 17-Jul-2002; LatestRevisionNote: Re-released for DXP Platform.; PackageReference: RAD-0.3; Publisher: Altium Limited
  C1 C9 C13 C15 C16 C18 C20 C23-C27 C29-C31 C33 C38 C42 C43 C46-C51: Value: 100nF
  C12 C45: Value: 10nF
  C14 C44: Value: 47nF
  C32 C34 C40 C41: Value: 18pF
C2 C28 C35-C37 C39 = Cap Pol1: Polarized Capacitor (Radial); Published: 8-Jun-2000; LatestRevisionDate: 17-Jul-2002; LatestRevisionNote: Re-released for DXP Platform.; PackageReference: RB7.6-15; Publisher: Altium Limited
  C2 C35 C36: Value: 10uF
  C28 C37: Value: 100uF
  C39: Value: 1000uF
C17 C19 = Cap: Capacitor; Value: 100nF; Published: 8-Jun-2000; LatestRevisionDate: 17-Jul-2002; LatestRevisionNote: Re-released for DXP Platform.; PackageReference: RAD-0.3; Publisher: Altium Limited
D3-D6 D15 = LED0: Typical INFRARED GaAs LED; Published: 8-Jun-2000; LatestRevisionDate: 08-Jul-2005; LatestRevisionNote: Mech Layer 1 removed.; PackageReference: LED-0; Publisher: Altium Limited
D10 D13 D14 = Diode 11DQ03: Schottky Rectifier; Published: 8-Jun-2000; LatestRevisionDate: 17-Jul-2002; LatestRevisionNote: Re-released for DXP Platform.; DatasheetVersion: Dec-1997; PackageReference: DO-204AL; Publisher: Altium Limited; Code_JEDEC: DO-204-AL; ComponentLink1Description: Manufacturer Link; ComponentLink1URL: http://www.irf.com/; ComponentLink2Description: Datasheet; ComponentLink2URL: http://www.irf.com/product-info/datasheets/data/11dq03.pdf
D11 D12 = Diode 1N4007: 1 Amp General Purpose Rectifier; Published: 8-Jun-2000; LatestRevisionDate: 17-Jul-2002; LatestRevisionNote: Re-released for DXP Platform.; DatasheetVersion: 1998; PackageVersion: Aug-1999; PackageReference: DO-41; Publisher: Altium Limited; Code_JEDEC: DO-204-AL; ComponentLink1Description: Manufacturer Link; ComponentLink1URL: http://www.fairchildsemi.com/; ComponentLink2Description: Datasheet; ComponentLink2URL: http://www.fairchildsemi.com/ds/1N%2F1N4001.pdf
FB3 FB4 FB6-FB9 = Fuse 1: Fuse; Published: 8-Jun-2000; LatestRevisionDate: 17-Jul-2002; LatestRevisionNote: Re-released for DXP Platform.; PackageReference: PIN-W2/E2.8; Publisher: Altium Limited
L2 = Inductor: Code_IEC: 1005; Published: 8-Jun-2000; LatestRevisionDate: 29-May-2009; LatestRevisionNote: IPC-7351 Footprint Added.; PackageReference: 0402-A; Publisher: Altium Limited; PackageDescription: Chip Inductor; Code_JEITA: 0402; Value: 100uH
M1#1 M2#1 M3#1 M4#1 = Board Screw: Board Screw With Spacer
m1#2 = ADMP441: mic1
MCP2551 = MCP2551-I/SN: 1/1 Transceiver Half CANbus 8-SOIC; MF: Microchip; Price: None; SnapEDA_Link: https://www.snapeda.com/parts/MCP2551-I/SN/Microchip/view-part/10929/?ref=snap; MP: MCP2551-I/SN; Value: *; Availability: Unavailable; Package: SOIC-8 Microchip
P1 P4 P9 P10 P16 = Header 3: Header, 3-Pin; LatestRevisionDate: 17-Jul-2002; LatestRevisionNote: Re-released for DXP Platform.; Publisher: Altium Limited
P2 = Header 20X2: Header, 20-Pin, Dual row; LatestRevisionDate: 17-Jul-2002; LatestRevisionNote: Re-released for DXP Platform.; Publisher: Altium Limited
P3 P11-P13 = Header 5: Header, 5-Pin; LatestRevisionDate: 17-Jul-2002; LatestRevisionNote: Re-released for DXP Platform.; Publisher: Altium Limited
P5 = Header 7X2: Header, 7-Pin, Dual row; LatestRevisionDate: 17-Jul-2002; LatestRevisionNote: Re-released for DXP Platform.; Publisher: Altium Limited
P6 P15 = Header 2: Header, 2-Pin; LatestRevisionDate: 17-Jul-2002; LatestRevisionNote: Re-released for DXP Platform.; Publisher: Altium Limited
P7 = Header 22X2: Header, 22-Pin, Dual row; LatestRevisionDate: 17-Jul-2002; LatestRevisionNote: Re-released for DXP Platform.; Publisher: Altium Limited
P8 = Header 4: Header, 4-Pin; LatestRevisionDate: 17-Jul-2002; LatestRevisionNote: Re-released for DXP Platform.; Publisher: Altium Limited
R1 R2 R4 R5 R7 R10 R11 R22 R29 R30 R34-R44 R49 = Res1: Resistor; Published: 8-Jun-2000; LatestRevisionDate: 17-Jul-2002; LatestRevisionNote: Re-released for DXP Platform.; PackageReference: AXIAL-0.3; Publisher: Altium Limited
  R1: Value: 6.8K
  R2 R4 R5 R7 R22 R34 R37 R42 R44 R49: Value: 1K
  R10 R11: Value: 270
  R29 R30 R36 R41 R43: Value: 10K
  R35: Value: 120
  R38 R39: Value: 4.7K
  R40: Value: 220
R3 R6 R23-R26 R45-R48 R50 = Res1: Resistor; Value: 1K; Published: 8-Jun-2000; LatestRevisionDate: 17-Jul-2002; LatestRevisionNote: Re-released for DXP Platform.; PackageReference: AXIAL-0.3; Publisher: Altium Limited
R51 R52 R54 = Res1: Resistor; Value: 47; Published: 8-Jun-2000; LatestRevisionDate: 17-Jul-2002; LatestRevisionNote: Re-released for DXP Platform.; PackageReference: AXIAL-0.3; Publisher: Altium Limited
R53 = Res1: Resistor; Value: 10K; Published: 8-Jun-2000; LatestRevisionDate: 17-Jul-2002; LatestRevisionNote: Re-released for DXP Platform.; PackageReference: AXIAL-0.3; Publisher: Altium Limited
S1 S3 S6 = SW-PB: Switch; Published: 24-Mar-1999; LatestRevisionDate: 17-Jul-2002; LatestRevisionNote: Re-released for DXP Platform.; PackageReference: SPST-2; Publisher: Altium Limited
S2 S4 S5 = SW-SPST: Single-Pole, Single-Throw Switch; Published: 24-Mar-1999; LatestRevisionDate: 17-Jul-2002; LatestRevisionNote: Re-released for DXP Platform.; PackageReference: SPST-2; Publisher: Altium Limited
SD1 = MICRO_SD_CARD_HOLDER
U = DWM1000: 802.15.4 IR-UWB Transceiver Module 3.5GHz ~ 6.5GHz Integrated, Chip Surface Mount; MF: Decawave Limited; Package: Module Decawave; Availability: Unavailable; Value: *; MP: DWM1000; SnapEDA_Link: https://www.snapeda.com/parts/DWM1000/Decawave%20Limited/view-part/327593/?ref=snap; Price: None
U1 = ESP8266
U5 = STM32H750VBT6TR: ARMÂ® CortexÂ®-M7 series Microcontroller IC 32-Bit Single-Core 480MHz 128KB (128K x 8) FLASH 100-LQFP (14x14); MF: STMicroelectronics; MP: STM32H750VBT6TR; Purchase-URL: https://pricing.snapeda.com/search/part/STM32H750VBT6TR/?ref=eda; Value: *; SnapEDA_Link: https://www.snapeda.com/parts/STM32H750VBT6TR/STMicroelectronics/view-part/?ref=snap; Price: None; Package: LQFP-100 STMicroelectronics; Check_prices: https://www.snapeda.com/parts/STM32H750VBT6TR/STMicroelectronics/view-part/?ref=eda; Availability: In Stock
U6 = HC-05: Bluetooth to Serial Port Module; MF: Bel Power solution; Value: *; Availability: Unavailable; Price: None; SnapEDA_Link: https://www.snapeda.com/parts/HC-05/Bel%20Power%20Solutions/view-part/106410/?ref=snap; Check_prices: https://www.snapeda.com/parts/HC-05/Bel%20Power%20Solutions/view-part/106410/?ref=eda; Package: SOIC-14; MP: HC-05
U8 = LD1117DT33
U9 = 24Cxx
U10 = LM2576HVT-5.0: SIMPLE SWITCHER; 3A Step-Down Voltage Regulator; Manufacturer: National Semiconductor; PackageTopMarking: NSUZXYTT*LM2576HVT*-5.0 P+; PowerWise: N; Published: 4-Dec-2008; DatasheetVersion: Aug-2004; PackageVersion: revJ, Jan-1992; PackageReference: T05A; Publisher: Altium Limited; PackageDescription: TO-220, Molded, 5 Lead, Straight; CompType: Switcher; PartNumber: LM2576HVT-5.0; RoHS: O; PinCount: 5; DigiKeyPartNumber: LM2576HVT-5.0-ND; Code_JEDEC: TO-220-AB; ComponentLink1Description: LM2576HV Datasheet; ComponentLink1URL: http://www.national.com/ds/LM/LM2576HV.pdf; ComponentLink2Description: LM2576HV Web Page; ComponentLink2URL: http://www.national.com/pf/LM/LM2576HV.html; ComponentLink3Description: T05A Package Page; ComponentLink3URL: http://www.national.com/packaging/folders/t05a.html
Y1 Y2 = XTAL: Crystal Oscillator; Published: 8-Jun-2000; LatestRevisionDate: 17-Jul-2002; LatestRevisionNote: Re-released for DXP Platform.; PackageReference: R38; Publisher: Altium Limited